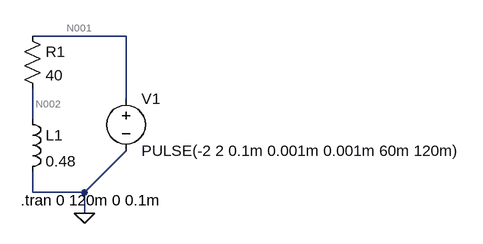
[diagram p0: schematic lab2-2.asc]
lab2-2.asc, the LTspice schematic file:
Version 4
SHEET 1 936 680
WIRE 256 0 112 0
WIRE 256 96 256 0
WIRE 112 128 112 80
WIRE 112 240 112 208
WIRE 192 240 256 176
WIRE 192 240 112 240
WIRE 192 272 192 240
FLAG 192 272 0
SYMBOL res 96 -16 R0
SYMATTR InstName R1
SYMATTR Value 40
SYMBOL voltage 256 80 R0
WINDOW 123 0 0 Left 0
WINDOW 39 0 0 Left 0
SYMATTR InstName V1
SYMATTR Value PULSE(-2 2 0.1m 0.001m 0.001m 60m 120m)
SYMBOL ind 96 112 R0
SYMATTR InstName L1
SYMATTR Value 0.48
TEXT 94 252 Left 2 !.tran 0 120m 0 0.1m

The netlist it stands for:
* lab2-2.asc
R1 N001 N002 40
V1 N001 0 PULSE(-2 2 0.1m 0.001m 0.001m 60m 120m)
L1 N002 0 0.48
.tran 0 120m 0 0.1m
.backanno
.end

* Results of the author's LTspice run, read from the files saved beside the schematic
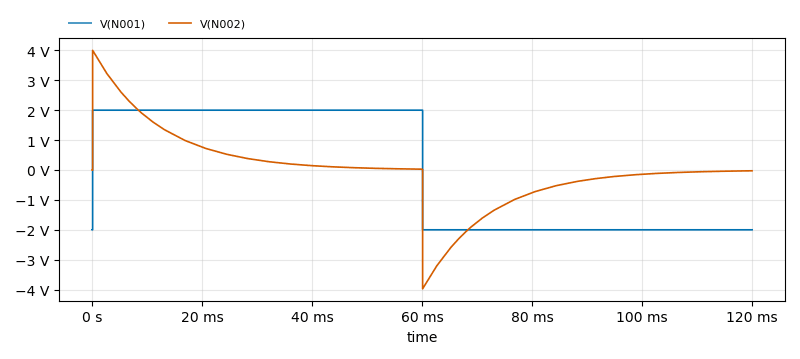
[diagram p1: Transient Analysis of lab2-2.asc, plotted from the saved traces]
* Transient Analysis, 1 run:
*   V(N001): min -2 V, max 2 V, average 33.33 µV, rms 2 V, last -2 V
*   V(N002): min -3.973 V, max 4 V, average 2.741 mV, rms 1.27 V, last -27.04 mV